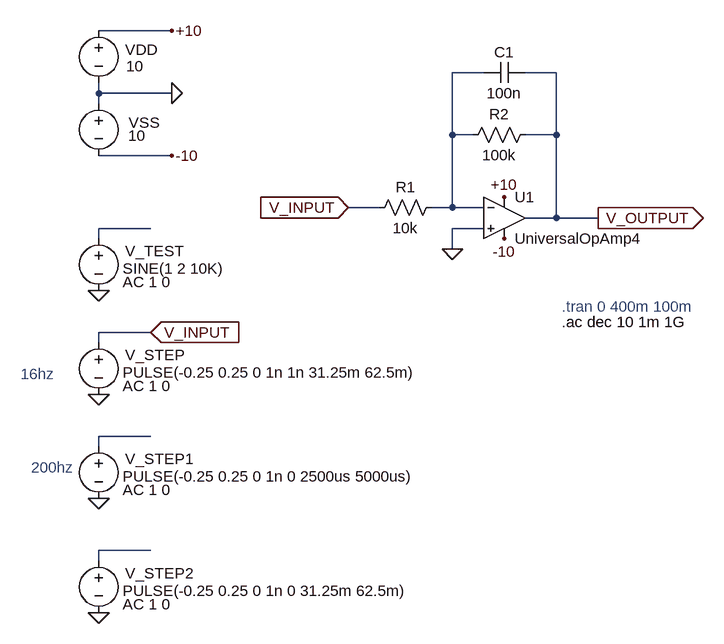
[diagram p0: schematic odwr_schem.asc]
odwr_schem.asc, the LTspice schematic file:
Version 4
SHEET 1 880 708
WIRE 32 -384 -80 -384
WIRE 512 -320 464 -320
WIRE 624 -320 576 -320
WIRE -80 -288 -80 -304
WIRE 32 -288 -80 -288
WIRE -80 -272 -80 -288
WIRE 464 -224 464 -320
WIRE 496 -224 464 -224
WIRE 624 -224 624 -320
WIRE 624 -224 576 -224
WIRE 32 -192 -80 -192
WIRE 352 -112 304 -112
WIRE 464 -112 464 -224
WIRE 464 -112 432 -112
WIRE 512 -112 464 -112
WIRE 624 -96 624 -224
WIRE 624 -96 576 -96
WIRE 688 -96 624 -96
WIRE 0 -80 -80 -80
WIRE 512 -80 464 -80
WIRE -80 -64 -80 -80
WIRE 464 -48 464 -80
WIRE 0 80 -80 80
WIRE -80 96 -80 80
WIRE 0 240 -80 240
WIRE -80 256 -80 240
WIRE 0 416 -80 416
WIRE -80 432 -80 416
FLAG 32 -384 +10
FLAG 32 -192 -10
FLAG 32 -288 0
FLAG 688 -96 V_OUTPUT
IOPIN 688 -96 Out
FLAG 544 -128 +10
FLAG 544 -64 -10
FLAG -80 16 0
FLAG -80 176 0
FLAG 304 -112 V_INPUT
IOPIN 304 -112 In
FLAG 464 -48 0
FLAG 0 80 V_INPUT
IOPIN 0 80 In
FLAG -80 336 0
FLAG -80 512 0
SYMBOL voltage -80 -400 R0
WINDOW 0 41 45 Left 2
WINDOW 3 42 70 Left 2
WINDOW 123 0 0 Left 0
WINDOW 39 0 0 Left 0
SYMATTR InstName VDD
SYMATTR Value 10
SYMBOL voltage -80 -288 R0
WINDOW 0 46 45 Left 2
WINDOW 3 45 65 Left 2
WINDOW 123 0 0 Left 0
WINDOW 39 0 0 Left 0
SYMATTR InstName VSS
SYMATTR Value 10
SYMBOL voltage -80 -80 R0
WINDOW 0 41 35 Left 2
WINDOW 3 37 62 Left 2
WINDOW 123 37 83 Left 2
WINDOW 39 0 0 Left 0
SYMATTR InstName V_TEST
SYMATTR Value SINE(1 2 10K)
SYMATTR Value2 AC 1 0
SYMBOL voltage -80 80 R0
WINDOW 0 41 35 Left 2
WINDOW 3 37 62 Left 2
WINDOW 123 37 83 Left 2
WINDOW 39 0 0 Left 0
SYMATTR InstName V_STEP
SYMATTR Value PULSE(-0.25 0.25 0 1n 1n 31.25m 62.5m)
SYMATTR Value2 AC 1 0
SYMBOL OpAmps\\UniversalOpAmp4 544 -96 R0
SYMATTR InstName U1
SYMATTR Value2 Avol=205k GBW=4MEG Slew=13MEG
SYMATTR SpiceLine Ilimit=25m Rail=0.6 Vos=5m Phimargin=45
SYMATTR SpiceLine2 En=0 Enk=0 In=0 Ink=0 Rin=1000000000000 Ro=1k Ccm=1p Cdiff=2p
SYMBOL res 448 -128 R90
WINDOW 0 0 56 VBottom 2
WINDOW 3 32 56 VTop 2
SYMATTR InstName R1
SYMATTR Value 10k
SYMBOL res 592 -240 R90
WINDOW 0 0 56 VBottom 2
WINDOW 3 32 56 VTop 2
SYMATTR InstName R2
SYMATTR Value 100k
SYMBOL cap 576 -336 R90
WINDOW 0 0 32 VBottom 2
WINDOW 3 32 32 VTop 2
SYMATTR InstName C1
SYMATTR Value 100n
SYMBOL voltage -80 240 R0
WINDOW 0 41 35 Left 2
WINDOW 3 37 62 Left 2
WINDOW 123 37 83 Left 2
WINDOW 39 0 0 Left 0
SYMATTR InstName V_STEP1
SYMATTR Value PULSE(-0.25 0.25 0 1n 0 2500us 5000us)
SYMATTR Value2 AC 1 0
SYMBOL voltage -80 416 R0
WINDOW 0 41 35 Left 2
WINDOW 3 37 62 Left 2
WINDOW 123 37 83 Left 2
WINDOW 39 0 0 Left 0
SYMATTR InstName V_STEP2
SYMATTR Value PULSE(-0.25 0.25 0 1n 0 31.25m 62.5m)
SYMATTR Value2 AC 1 0
TEXT 632 40 Left 2 ;.tran 0 400m 100m
TEXT 632 64 Left 2 !.ac dec 10 1m 1G
TEXT -200 144 Left 2 ;16hz
TEXT -184 288 Left 2 ;200hz

The netlist it stands for:
* odwr_schem.asc
VDD +10 0 10
VSS 0 -10 10
V_TEST N002 0 SINE(1 2 10K) AC 1 0
V_STEP V_INPUT 0 PULSE(-0.25 0.25 0 1n 1n 31.25m 62.5m) AC 1 0
* U1: UniversalOpAmp4 Avol=205k GBW=4MEG Slew=13MEG Ilimit=25m Rail=0.6 Vos=5m Phimargin=45 En=0 Enk=0 In=0 Ink=0 Rin=1000000000000 Ro=1k Ccm=1p Cdiff=2p (symbol OpAmps\UniversalOpAmp4 not available, pins judged from their places): In+=0 In-=N001 V+=+10 V-=-10 OUT=V_OUTPUT
R1 N001 V_INPUT 10k
R2 V_OUTPUT N001 100k
C1 V_OUTPUT N001 100n
V_STEP1 N003 0 PULSE(-0.25 0.25 0 1n 0 2500us 5000us) AC 1 0
V_STEP2 N004 0 PULSE(-0.25 0.25 0 1n 0 31.25m 62.5m) AC 1 0
* .tran 0 400m 100m
.ac dec 10 1m 1G
* 16hz
* 200hz
.backanno
.end